# Altium schematic sheet Connector_page.SchDoc
size A; SheetNumber: 2; SheetTotal: 2
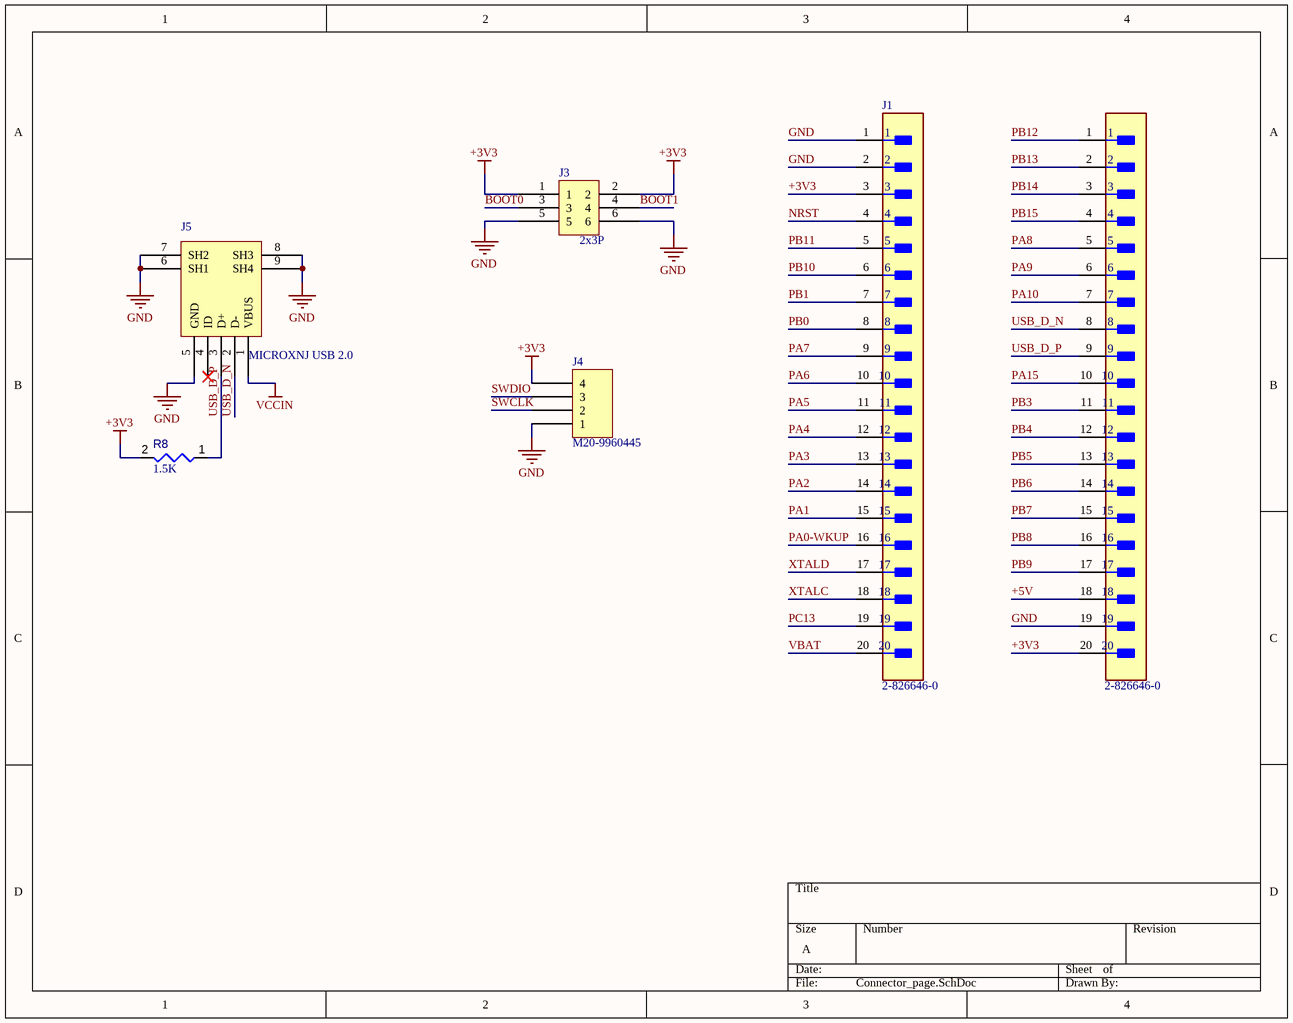
[diagram p0: Connector_page.SchDoc]

## Parts
J1  2-826646-0  [FP-2-826646-0-MFG]
J3  2x3P  [2x3P 2.54mm Pin Header -Footprint-1]
J4  M20-9960445  [HARWIN M20-9960445]
J5  MICROXNJ USB 2.0  [USB 2.0 Tupe B Micro]
R8  value 1.5K  [RESC0805(2012)_L]  (hidden comment: 470R5J)
  2-826646-0  [FP-2-826646-0-MFG]

## Nets
+3V3: J1.3 J3.1 J3.2 J4.4 R8.2 .20
GND: J1.1 J1.2 J3.5 J3.6 J4.1 J5.5(GND) J5.6(SH1) J5.7(SH2) J5.8(SH3) J5.9(SH4) .19
VCCIN: J5.1(VBUS)
+5V: .18
BOOT0: J3.3
BOOT1: J3.4
NRST: J1.4
PA0-WKUP: J1.16
PA1: J1.15
PA2: J1.14
PA3: J1.13
PA4: J1.12
PA5: J1.11
PA6: J1.10
PA7: J1.9
PA8: .5
PA9: .6
PA10: .7
PA15: .10
PB0: J1.8
PB1: J1.7
PB3: .11
PB4: .12
PB5: .13
PB6: .14
PB7: .15
PB8: .16
PB9: .17
PB10: J1.6
PB11: J1.5
PB12: .1
PB13: .2
PB14: .3
PB15: .4
PC13: J1.19
SWCLK: J4.2
SWDIO: J4.3
USB_D_N: J5.2(D-) .8
USB_D_P: J5.3(D+) R8.1 .9
VBAT: J1.20
XTALC: J1.18
XTALD: J1.17

Not connected (* = marked no-connect by the designer): J5 4(ID)*

## Library data of the parts
J1  = CMP-03369-000139-1: CONN HEADER VERT 20POS 2.54MM; Mating Connector Lock: No (Without); High Temperature Housing: No; Current Rating: 3A; Number of Positions: 20; PCB Mounting Orientation: Vertical; Connector Type: Plug; PCB Mount Retention: Without; Plating Thickness: 0.8um; Contact Post Length: 0.1259inch; Selectively Loaded: No (Without); Series: AMPMODU MOD II; Number of Rows: 1; Housing Color: Green; Mount: Straddle Mount; Max Operating Temperature: 105°C; Packaging: Carton; Row Spacing: 2.54mm; Board Standoff: No (Without); RoHS Compliant: Yes; Orientation: Straight; Contact Protection: No (Without); Strain Relief: No (Without); Keyed: No; Radiation Hardening: No; Package Quantity: 300; Contact Mating Length: 5.8mm; Termination: Through Hole; Contact Shape: Square; Length: 50.8mm; Pitch: 2.54mm; Stabilizers: No (Without); Gasket: No (Without); Number of Contacts: 20; Contact Gender: Male; Mating Alignment: No (Without); Min Operating Temperature: -65°C; Contact Type: Male Pin; Contact Plating: Gold; Flammability Rating: UL94 V-0; Housing Material: PBT; Color: Green; High Speed Serial Data Connector: No; Depth: 2.5mm; ELV: Compliant; Contact Material: Bronze
J3 = CMP-002-00390-1: PZ254-2-03-Z-8.5; Gender: Male; Max Current Rating: 3A; Connector Type: Pin Header; RoHS Compliant: Yes; Mounting Technology: TH; Pins: 6; Case/Package: Plugin, P=2.54mm
J4 = M20-9960445: CONN HEADER R/A 4POS 2.54MM; Manufacturer: Harwin Inc.; Connector Type: Header, Cuttable; Contact Length - Mating: 0.240" (6.10mm); Contact Length - Post: 0.118" (3.00mm); Current Rating (Amps): 3A per Contact; Material Flammability Rating: UL94 V-0; Number of Positions: 4; Number of Positions Loaded: All; Pitch - Mating: 0.100" (2.54mm); Row Spacing - Mating: -40°C ~ 105°C; Shrouding: Unshrouded; Style: Board to Board or Cable; Part Number: M20-9960445; ComponentLink1Description: Datasheet; ComponentLink1URL: https://cdn.harwin.com/pdfs/Harwin_PC_Connectors_M20.pdf; ComponentLink2Description: DigiKey Link; ComponentLink2URL: https://www.digikey.com/en/products/detail/harwin-inc/M20-9960445/3921052; Contact Finish - Mating: Gold; Contact Material: Brass; Contact Shape: Square; Contact Type: Male Pin; Fastening Type: Push-Pull; Insulation Color: Black; Insulation Height: 0.100" (2.54mm); Insulation Material: Polyamide (PA6T), Nylon 6T; LastUpdated: 9/21/2022 7:23:20 PM; Lifecycle Status: Active; Minimum Order: 1; Mounting Type: Through Hole, Right Angle; Number of Rows: 1; Operating Temperature: -40°C ~ 105°C; Packaging: Bulk; PartId: 167; Part Status: Active; Price: 0.11; Series: M20; Supplier 1: DigiKey; Supplier Part Number 1: 952-3286-ND; Termination: Solder
J5 = CMP-002-00071-9: 1A USB 2.0 1 Surface Mount 5P Female -20℃~+85℃ Micro-B SMD USB Connectors ROHS; Pins: 9; Min Operating Temperature: -25°C; Gender: Female; RoHS Compliant: Yes; Mounting Technology: SMD; Max Current Rating: 1A; Max Operating Temperature: 85°C; Case/Package: USB 2.0; Connector Type: Micro-B
R8 = CMP-009-00102-2: 470R 0.125W 5% 0805 (2012 Metric)  SMD; Power: 125mW; Pins: 2; Case/Package: 0805; Mounting Technology: SMT; Tolerance: 5%